# EAGLE schematic Uloha2 (EAGLE 9.6.2)
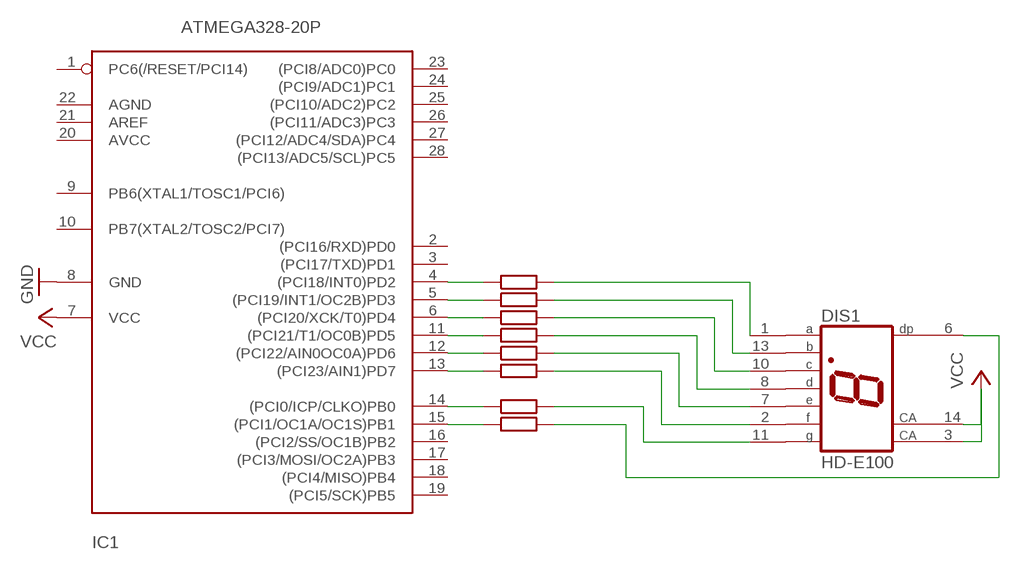
[diagram p0: schematic, sheet 1]

## Parts
DIS1  HD-E100  [HDSP-I]
IC1  ATMEGA328-20P  [DIL28-3]

## Nets
GND: IC1.8(GND)
N$1: DIS1.1(A)
N$2: DIS1.13(B)
N$3: DIS1.10(C)
N$4: DIS1.8(D)
N$5: DIS1.7(E)
N$6: DIS1.2(F)
N$7: DIS1.11(G)
N$8: DIS1.6(DP)
N$9: IC1.4((PCI18/INT0)PD2)
N$10: IC1.5((PCI19/INT1/OC2B)PD3)
N$11: IC1.6((PCI20/XCK/T0)PD4)
N$12: IC1.11((PCI21/T1/OC0B)PD5)
N$13: IC1.12((PCI22/AIN0OC0A)PD6)
N$14: IC1.13((PCI23/AIN1)PD7)
N$15: IC1.14((PCI0/ICP/CLKO)PB0)
N$16: IC1.15((PCI1/OC1A/OC1S)PB1)
VCC: DIS1.3(CA) DIS1.14(CA) IC1.7(VCC)
Unconnected: IC1.1(PC6(/RESET/PCI14)) IC1.2((PCI16/RXD)PD0) IC1.3((PCI17/TXD)PD1) IC1.9(PB6(XTAL1/TOSC1/PCI6)) IC1.10(PB7(XTAL2/TOSC2/PCI7)) IC1.16((PCI2/SS/OC1B)PB2) IC1.17((PCI3/MOSI/OC2A)PB3) IC1.18((PCI4/MISO)PB4) IC1.19((PCI5/SCK)PB5) IC1.20(AVCC) IC1.21(AREF) IC1.22(AGND) IC1.23((PCI8/ADC0)PC0) IC1.24((PCI9/ADC1)PC1) IC1.25((PCI10/ADC2)PC2) IC1.26((PCI11/ADC3)PC3) IC1.27((PCI12/ADC4/SDA)PC4) IC1.28((PCI13/ADC5/SCL)PC5)

## Library data of the parts
DIS1 = display-hp:HD-E100: LED DISPLAY 1-character 7 segment, decimal point left; OC_FARNELL: unknown; OC_NEWARK: unknown
IC1 = atmega328:ATMEGA328*P: MICROCONTROLLER 32 kBytes FLASH 2 kBytes SRAM 1 kBytes EEPROM USART 8-channel 10 bit ADC